# EAGLE schematic Low Voltage Power Supply (EAGLE 6.2)
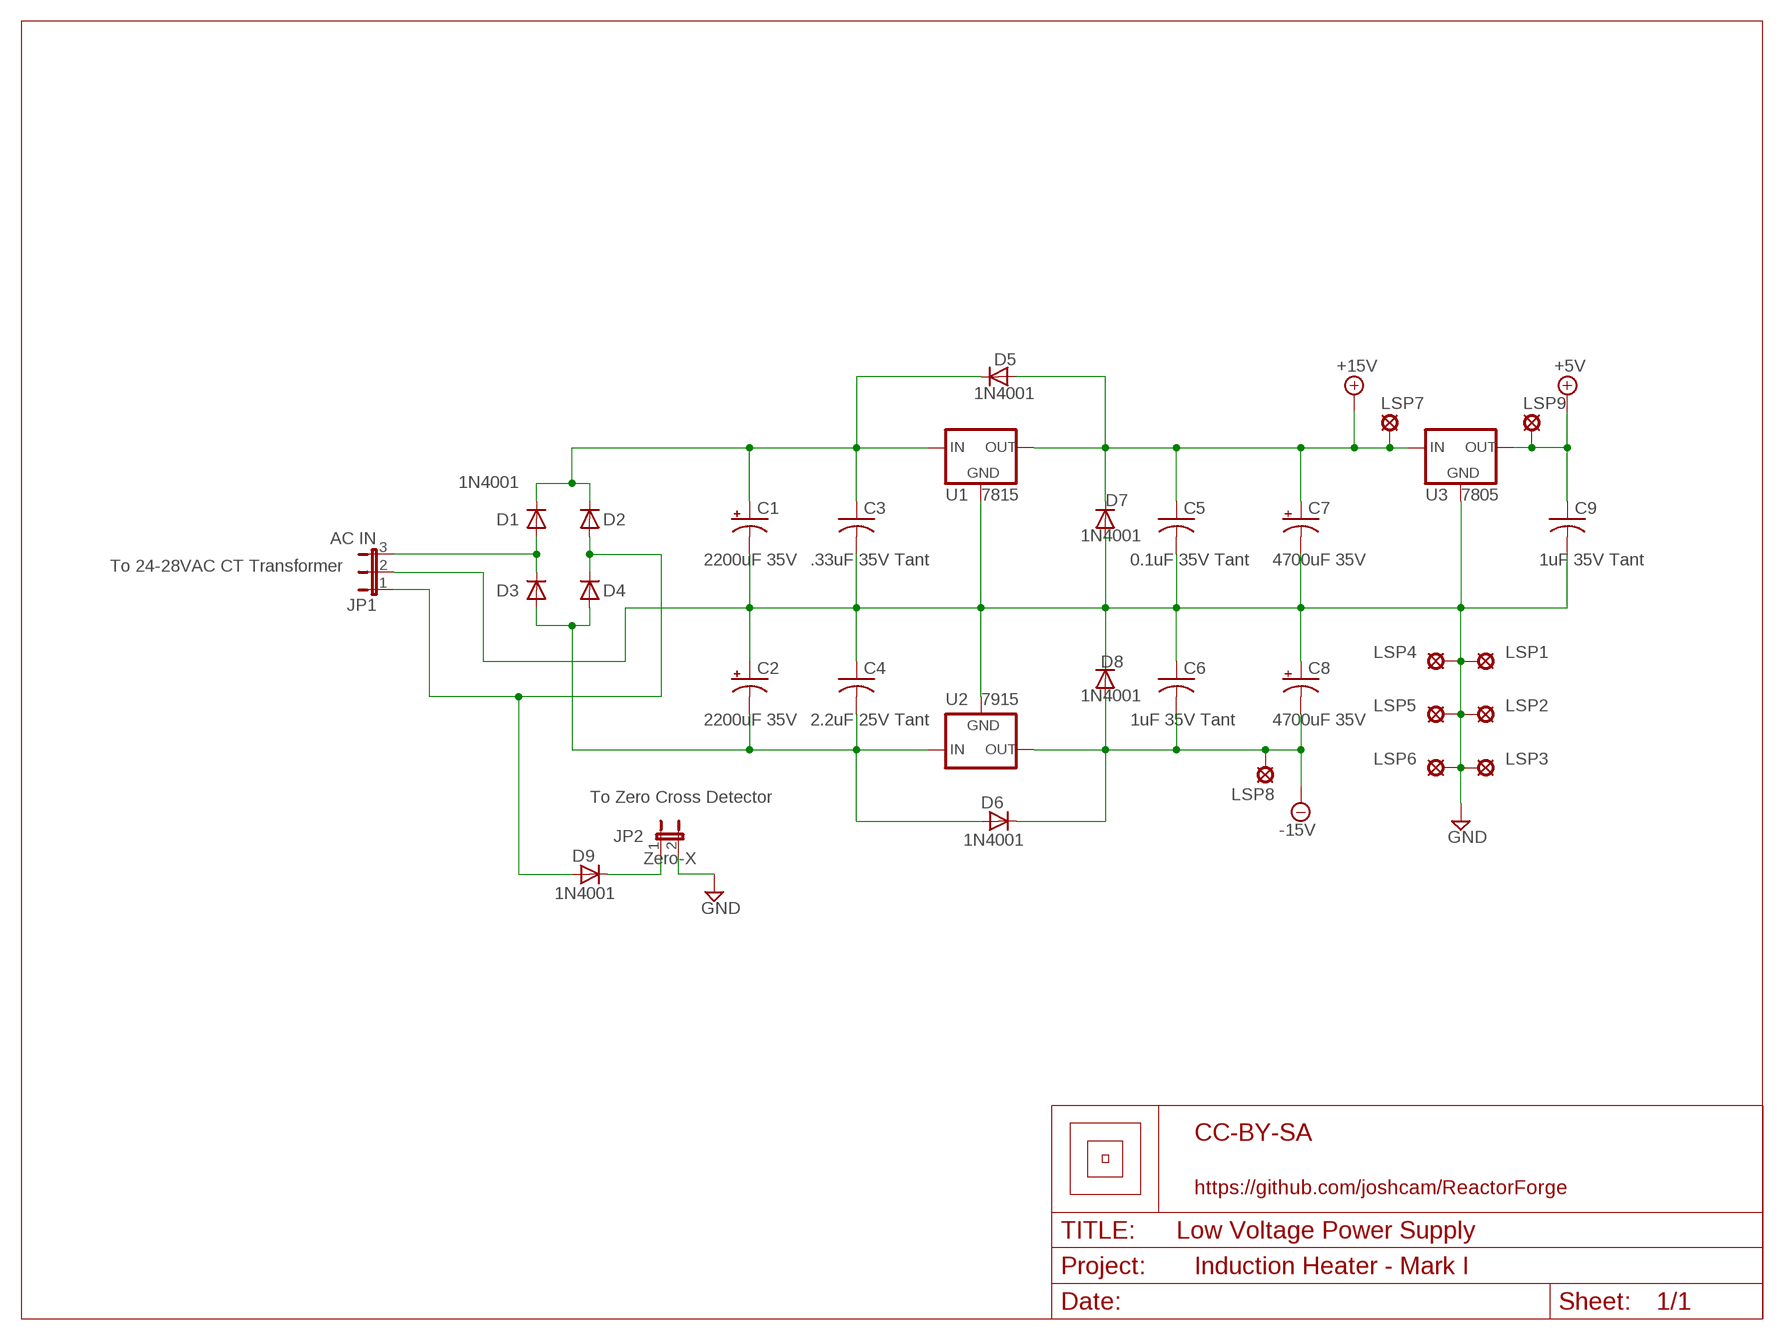
[diagram p0: schematic, sheet 1]
U$1 (LETTER_L): LICENSE: CC-BY-SA; PROJECT: Induction Heater - Mark I; URL: https://github.com/joshcam/ReactorForge

## Parts
C1  2200uF 35V  CPOL-USE7.5-18  [E7,5-18]
C2  2200uF 35V  CPOL-USE7.5-18  [E7,5-18]
C3  .33uF 35V Tant  C-USC1206  [C1206]
C4  2.2uF 25V Tant  C-USC1206  [C1206]
C5  0.1uF 35V Tant  C-USC1206  [C1206]
C6  1uF 35V Tant  C-USC1206  [C1206]
C7  4700uF 35V  CPOL-USE7.5-18  [E7,5-18]
C8  4700uF 35V  CPOL-USE7.5-18  [E7,5-18]
C9  1uF 35V Tant  C-USC1206  [C1206]
D1  1N4001  [DIODE.4-AXIAL]
D2  1N4001  [DIODE.4-AXIAL]
D3  1N4001  [DIODE.4-AXIAL]
D4  1N4001  [DIODE.4-AXIAL]
D5  1N4001  [DIODE.4-AXIAL]
D6  1N4001  [DIODE.4-AXIAL]
D7  1N4001  [DIODE.4-AXIAL]
D8  1N4001  [DIODE.4-AXIAL]
D9  1N4001  [DIODE.4-AXIAL]
JP1  AC IN  JP2E  [JP2]
JP2  Zero-X  JP1E  [JP1]
LSP1  SE14  [SE14]
LSP2  SE14  [SE14]
LSP3  SE14  [SE14]
LSP4  SE14  [SE14]
LSP5  SE14  [SE14]
LSP6  SE14  [SE14]
LSP7  SE14  [SE14]
LSP8  SE14  [SE14]
LSP9  SE14  [SE14]
U1  7815  78XXS  [78XXS]
U2  7915  79XXS  [79XXS]
U3  7805  78XXS  [78XXS]

## Nets
+5V: C9.1 LSP9.MP U3.OUT
+15V: C5.1 C7.+ D5.A D7.C LSP7.MP U1.OUT U3.IN
-15V: C6.2 C8.- D6.C D8.A LSP8.MP U2.OUT
GND: C1.- C2.+ C3.2 C4.1 C5.2 C6.1 C7.- C8.+ C9.2 D7.A D8.C JP1.2 JP2.2 LSP1.MP LSP2.MP LSP3.MP LSP4.MP LSP5.MP LSP6.MP U1.GND U2.GND U3.GND
N$1: C1.+ C3.1 D1.C D2.C D5.C U1.IN
N$2: D2.A D4.C D9.A JP1.1
N$3: D1.A D3.C JP1.3
N$4: C2.- C4.2 D3.A D4.A D6.A U2.IN
N$9: D9.C JP2.1

## Notes on the sheet
- To 24-28VAC CT Transformer
- To Zero Cross Detector

## Library data of the parts
C1 C2 C7 C8 = resistor:CPOL-US: POLARIZED CAPACITOR, American symbol
C3-C6 C9 = resistor:C-US: CAPACITOR, American symbol
D1-D9 = 1-Custom:1N4001: 1N4001 General Purpose Rectifier Diode
JP1 = jumper:JP2E: JUMPER
JP2 = jumper:JP1E: JUMPER
LSP1-LSP9 = solpad:SE14: SOLDER PAD E1553, drill 1,4mm, distributor Buerklin, 07F820
U1 U3 = v-reg:78XXS: VOLTAGE REGULATOR
U2 = v-reg:79XXS: VOLTAGE REGULATOR